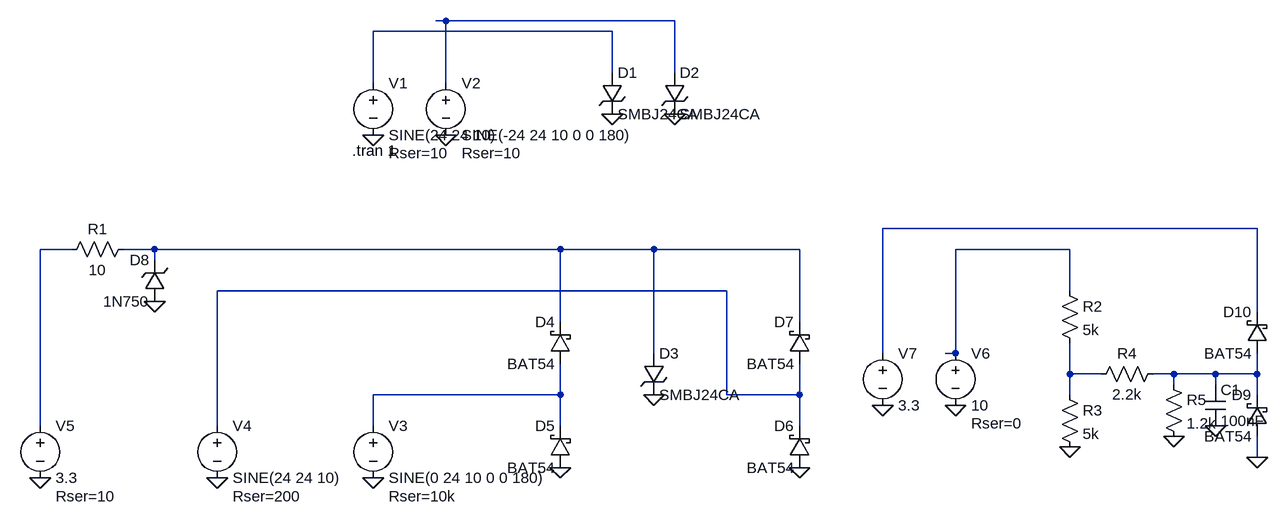
[diagram p0: schematic VoltageClamps.asc]
VoltageClamps.asc, the LTspice schematic file:
Version 4
SHEET 1 1224 844
WIRE -48 96 -64 96
WIRE 304 96 -48 96
WIRE 208 112 -160 112
WIRE 208 176 208 112
WIRE 304 176 304 96
WIRE -160 192 -160 112
WIRE -48 192 -48 96
WIRE 1200 416 624 416
WIRE -624 448 -672 448
WIRE -496 448 -544 448
WIRE 128 448 -496 448
WIRE 272 448 128 448
WIRE 496 448 272 448
WIRE 912 448 736 448
WIRE -496 464 -496 448
WIRE 384 512 -400 512
WIRE 912 512 912 448
WIRE 1200 544 1200 416
WIRE 128 560 128 448
WIRE 496 560 496 448
WIRE 272 608 272 448
WIRE 624 608 624 416
WIRE 736 608 736 448
WIRE 736 608 720 608
WIRE 912 640 912 592
WIRE 960 640 912 640
WIRE 1072 640 1040 640
WIRE 1136 640 1072 640
WIRE 1200 640 1200 608
WIRE 1200 640 1136 640
WIRE 1072 656 1072 640
WIRE 1136 656 1136 640
WIRE 128 672 128 624
WIRE 128 672 -160 672
WIRE 384 672 384 512
WIRE 496 672 496 624
WIRE 496 672 384 672
WIRE 912 672 912 640
WIRE 1200 672 1200 640
WIRE -672 720 -672 448
WIRE -400 720 -400 512
WIRE -160 720 -160 672
WIRE 128 720 128 672
WIRE 496 720 496 672
WIRE 1200 768 1200 736
FLAG -160 272 0
FLAG -48 272 0
FLAG 208 240 0
FLAG 304 240 0
FLAG -160 800 0
FLAG -400 800 0
FLAG -672 800 0
FLAG 272 672 0
FLAG 128 784 0
FLAG 496 784 0
FLAG -496 528 0
FLAG 1200 768 0
FLAG 912 752 0
FLAG 736 688 0
FLAG 624 688 0
FLAG 1072 736 0
FLAG 1136 720 0
SYMBOL TVSdiode 192 176 R0
WINDOW 0 24 0 Left 2
WINDOW 3 24 64 Left 2
SYMATTR InstName D1
SYMATTR Value SMBJ24CA
SYMATTR Description Diode
SYMATTR Type diode
SYMBOL TVSdiode 288 176 R0
WINDOW 0 24 0 Left 2
WINDOW 3 24 64 Left 2
SYMATTR InstName D2
SYMATTR Value SMBJ24CA
SYMATTR Description Diode
SYMATTR Type diode
SYMBOL voltage -160 176 R0
WINDOW 123 0 0 Left 2
WINDOW 39 24 124 Left 2
SYMATTR SpiceLine Rser=10
SYMATTR InstName V1
SYMATTR Value SINE(24 24 10)
SYMBOL voltage -48 176 R0
WINDOW 123 0 0 Left 2
WINDOW 39 24 124 Left 2
SYMATTR SpiceLine Rser=10
SYMATTR InstName V2
SYMATTR Value SINE(-24 24 10 0 0 180)
SYMBOL TVSdiode 256 608 R0
WINDOW 0 24 0 Left 2
WINDOW 3 24 64 Left 2
SYMATTR InstName D3
SYMATTR Value SMBJ24CA
SYMATTR Description Diode
SYMATTR Type diode
SYMBOL schottky 144 624 R180
WINDOW 0 24 64 Left 2
WINDOW 3 24 0 Left 2
SYMATTR InstName D4
SYMATTR Value BAT54
SYMATTR Description Diode
SYMATTR Type diode
SYMBOL schottky 144 784 R180
WINDOW 0 24 64 Left 2
WINDOW 3 24 0 Left 2
SYMATTR InstName D5
SYMATTR Value BAT54
SYMATTR Description Diode
SYMATTR Type diode
SYMBOL schottky 512 784 R180
WINDOW 0 24 64 Left 2
WINDOW 3 24 0 Left 2
SYMATTR InstName D6
SYMATTR Value BAT54
SYMATTR Description Diode
SYMATTR Type diode
SYMBOL schottky 512 624 R180
WINDOW 0 24 64 Left 2
WINDOW 3 24 0 Left 2
SYMATTR InstName D7
SYMATTR Value BAT54
SYMATTR Description Diode
SYMATTR Type diode
SYMBOL voltage -160 704 R0
WINDOW 123 0 0 Left 2
WINDOW 39 24 124 Left 2
SYMATTR SpiceLine Rser=10k
SYMATTR InstName V3
SYMATTR Value SINE(0 24 10 0 0 180)
SYMBOL voltage -400 704 R0
WINDOW 123 0 0 Left 2
WINDOW 39 24 124 Left 2
SYMATTR SpiceLine Rser=200
SYMATTR InstName V4
SYMATTR Value SINE(24 24 10)
SYMBOL voltage -672 704 R0
WINDOW 123 0 0 Left 2
WINDOW 39 24 124 Left 2
SYMATTR SpiceLine Rser=10
SYMATTR InstName V5
SYMATTR Value 3.3
SYMBOL zener -480 528 R180
WINDOW 0 24 64 Left 2
WINDOW 3 24 0 Left 2
SYMATTR InstName D8
SYMATTR Value 1N750
SYMATTR Description Diode
SYMATTR Type diode
SYMBOL res -528 432 R90
WINDOW 0 0 56 VBottom 2
WINDOW 3 32 56 VTop 2
SYMATTR InstName R1
SYMATTR Value 10
SYMBOL res 896 496 R0
SYMATTR InstName R2
SYMATTR Value 5k
SYMBOL res 896 656 R0
SYMATTR InstName R3
SYMATTR Value 5k
SYMBOL res 1056 624 R90
WINDOW 0 0 56 VBottom 2
WINDOW 3 32 56 VTop 2
SYMATTR InstName R4
SYMATTR Value 2.2k
SYMBOL voltage 736 592 R0
WINDOW 123 0 0 Left 2
WINDOW 39 24 124 Left 2
SYMATTR SpiceLine Rser=0
SYMATTR InstName V6
SYMATTR Value 10
SYMBOL schottky 1216 736 R180
WINDOW 0 24 64 Left 2
WINDOW 3 24 0 Left 2
SYMATTR InstName D9
SYMATTR Value BAT54
SYMATTR Description Diode
SYMATTR Type diode
SYMBOL schottky 1216 608 R180
WINDOW 0 24 64 Left 2
WINDOW 3 24 0 Left 2
SYMATTR InstName D10
SYMATTR Value BAT54
SYMATTR Description Diode
SYMATTR Type diode
SYMBOL voltage 624 592 R0
WINDOW 123 0 0 Left 2
WINDOW 39 0 0 Left 2
SYMATTR InstName V7
SYMATTR Value 3.3
SYMBOL res 1056 640 R0
SYMATTR InstName R5
SYMATTR Value 1.2k
SYMBOL cap 1120 656 R0
SYMATTR InstName C1
SYMATTR Value 100nF
TEXT -192 296 Left 2 !.tran 1

The netlist it stands for:
* VoltageClamps.asc
D1 N002 0 SMBJ24CA
D2 N001 0 SMBJ24CA
V1 N002 0 SINE(24 24 10) Rser=10
V2 N001 0 SINE(-24 24 10 0 0 180) Rser=10
D3 N005 0 SMBJ24CA
D4 N010 N005 BAT54
D5 0 N010 BAT54
D6 0 N007 BAT54
D7 N007 N005 BAT54
V3 N010 0 SINE(0 24 10 0 0 180) Rser=10k
V4 N007 0 SINE(24 24 10) Rser=200
V5 N004 0 3.3 Rser=10
D8 0 N005 1N750
R1 N005 N004 10
R2 N006 N008 5k
R3 N008 0 5k
R4 N009 N008 2.2k
V6 N006 0 10 Rser=0
D9 0 N009 BAT54
D10 N009 N003 BAT54
V7 N003 0 3.3
R5 N009 0 1.2k
C1 N009 0 100nF
.model D D
.lib standard.dio
.tran 1
.backanno
.end